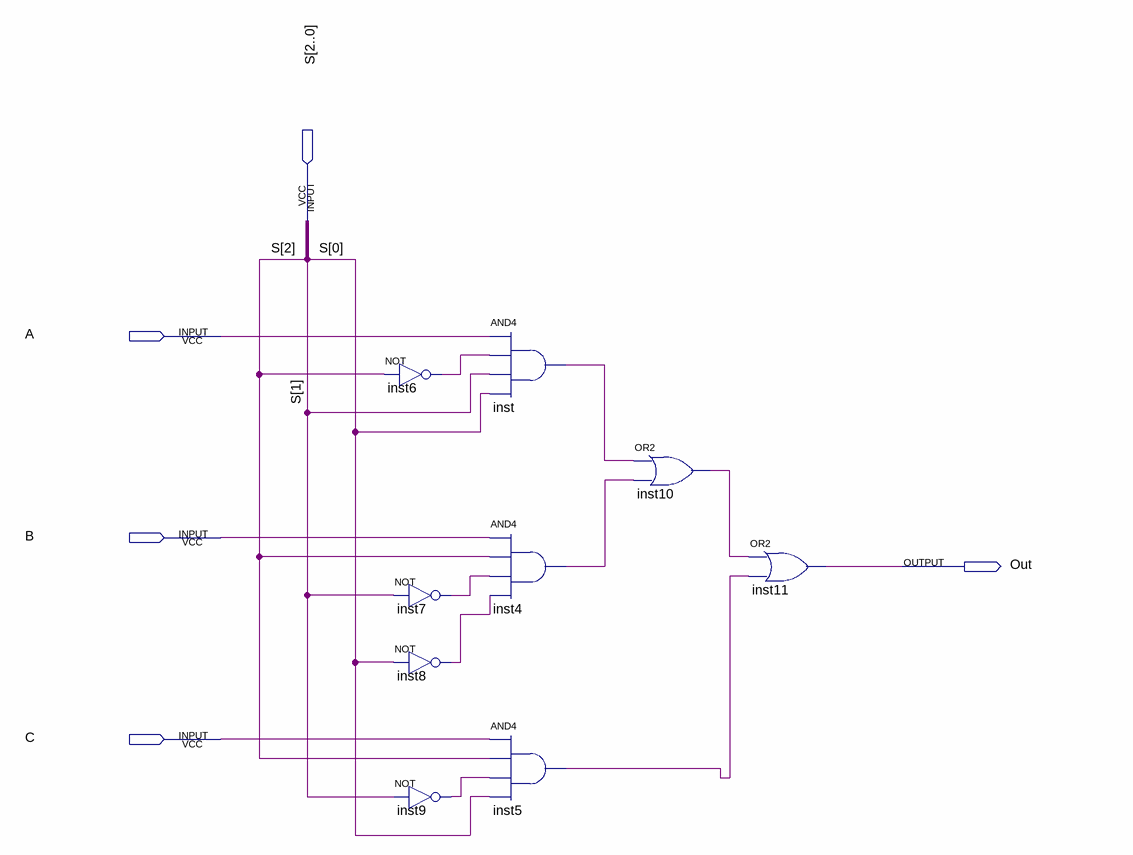
[diagram p0: schematic sheet]
// Quartus schematic mux_3_1bit.bdf as structural Verilog: 9 symbols, 5 pins
module mux_3_1bit (
  input  [2:0] S,
  input  A,
  input  B,
  input  C,
  output Out
);

  wire inst4_out, inst5_out, inst6_out, inst7_out, inst8_out, inst9_out, inst10_out, inst_out;

  not inst6 (inst6_out, S[2]);
  not inst7 (inst7_out, S[1]);
  not inst8 (inst8_out, S[0]);
  not inst9 (inst9_out, S[1]);
  and inst (inst_out, A, inst6_out, S[1], S[0]);
  and inst4 (inst4_out, B, S[2], inst7_out, inst8_out);
  and inst5 (inst5_out, C, S[2], inst9_out, S[0]);
  or inst10 (inst10_out, inst_out, inst4_out);
  or inst11 (Out, inst10_out, inst5_out);
endmodule
